# EAGLE design PSU R1 (EAGLE 9.6.2)
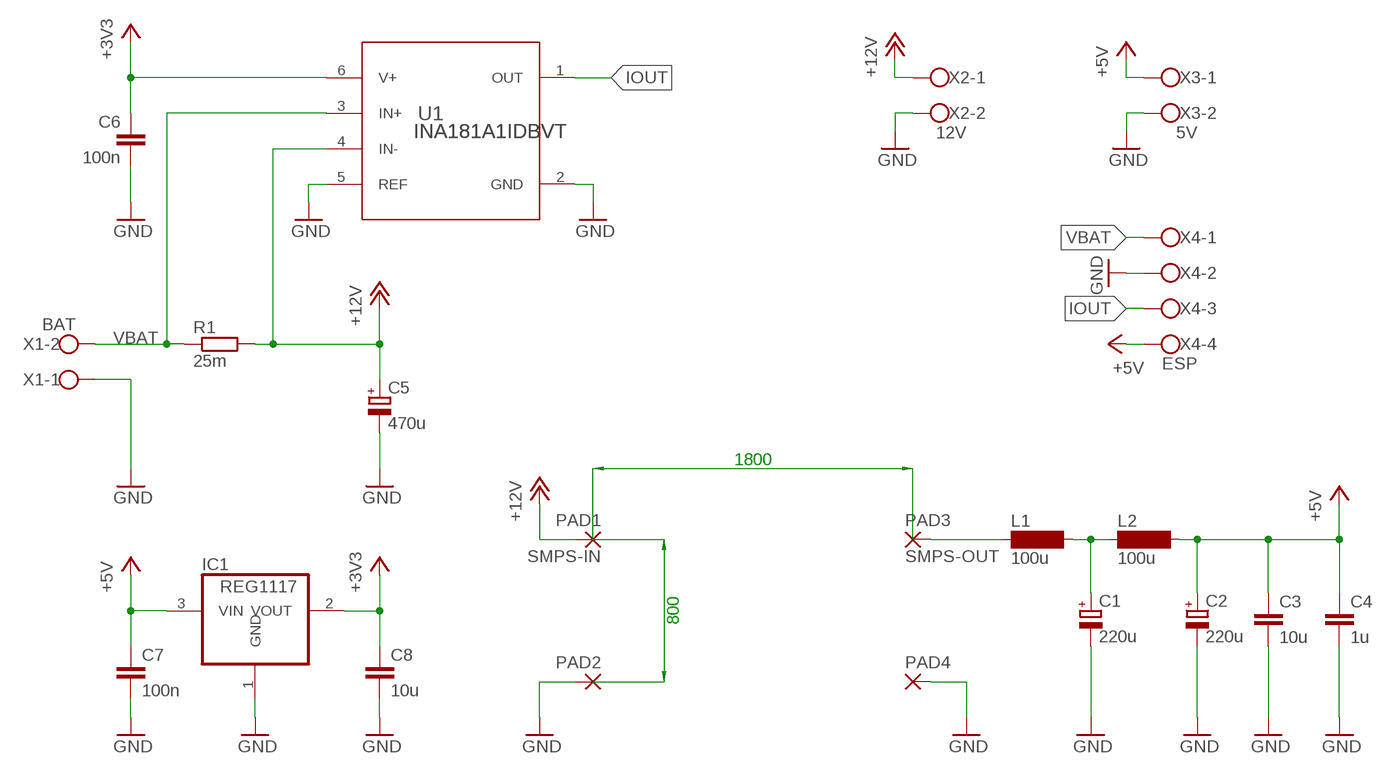
[diagram p0: schematic, sheet 1]

## Parts
C1  220u  CPOL-EUE2.5-6  [E2,5-6]
C2  220u  CPOL-EUE2.5-6  [E2,5-6]
C3  10u  C-EUC1206  [C1206]
C4  1u  C-EUC0805  [C0805]
C5  470u  CPOL-EUE5-10.5  [E5-10,5]
C6  100n  C-EUC0603  [C0603]
C7  100n  C-EUC0603  [C0603]
C8  10u  C-EUC1206  [C1206]
IC1  REG1117  [SOT223]
L1  100u  SD8  [SD8]
L2  100u  SD8  [SD8]
PAD1  SMPS-IN  1,6/0,9  [1,6/0,9]
PAD2  1,6/0,9  [1,6/0,9]
PAD3  SMPS-OUT  1,6/0,9  [1,6/0,9]
PAD4  1,6/0,9  [1,6/0,9]
R1  25m  R-EU_R2512  [R2512]
U1  INA181A1IDBVT  [DBV0006A_N]
X1  BAT  W237-102  [W237-102]
X2  12V  W237-102  [W237-102]
X3  5V  W237-102  [W237-102]
X4  ESP  W237-4  [W237-4]

## Nets
+3V3: C6.1 C8.1 IC1.2(VOUT) U1.6(V+)
+5V: C2.+ C3.1 C4.1 C7.1 IC1.3(VIN) L2.2 X3.1 X4.4
+12V: C5.+ PAD1.1(P) R1.2 U1.4(IN-) X2.1
GND: C1.- C2.- C3.2 C4.2 C5.- C6.2 C7.2 C8.2 IC1.1(GND) PAD2.1(P) PAD4.1(P) U1.2(GND) U1.5(REF) X1.1 X2.2 X3.2 X4.2
IOUT: U1.1(OUT) X4.3
N$1: L1.1 PAD3.1(P)
N$2: C1.+ L1.2 L2.1
VBAT: R1.1 U1.3(IN+) X1.2 X4.1

## Library data of the parts
C1 C2 C5 = rcl:CPOL-EU: POLARIZED CAPACITOR, European symbol; SPICEPREFIX: C
C3 C4 C6-C8 = rcl:C-EU: CAPACITOR, European symbol; SPICEPREFIX: C
IC1 = burr-brown:REG1117: 800mA and 1A Low Dropout (LDO) Positive Regulator 1.8V, 2.5V, 2.85V, 3.3V, 5V, and Adj; MPN: REG1117; OC_FARNELL: 1097566; OC_NEWARK: 14P6981
L1 L2 = inductor-neosid:SD8: INDUCTOR nominal inductance; OC_FARNELL: unknown; OC_NEWARK: unknown
PAD1-PAD4 = wirepad:1,6/0,9: THROUGH-HOLE PAD
R1 = rcl:R-EU_: RESISTOR, European symbol; SPICEPREFIX: R
U1 = user:INA181A1IDBVT; COPYRIGHT: Copyright (C) 2023 Ultra Librarian. All rights reserved.; MANUFACTURER_PART_NUMBER: INA181A1IDBVT; MFR_NAME: Texas Instruments; REFDES: RefDes; TYPE: TYPE
X1-X3 = con-wago-500:W237-102: WAGO SCREW CLAMP; MPN: 237-102; OC_FARNELL: unknown; OC_NEWARK: 70K9898
X4 = con-wago-500:W237-4: WAGO SCREW CLAMP; OC_FARNELL: unknown; OC_NEWARK: unknown

## Board
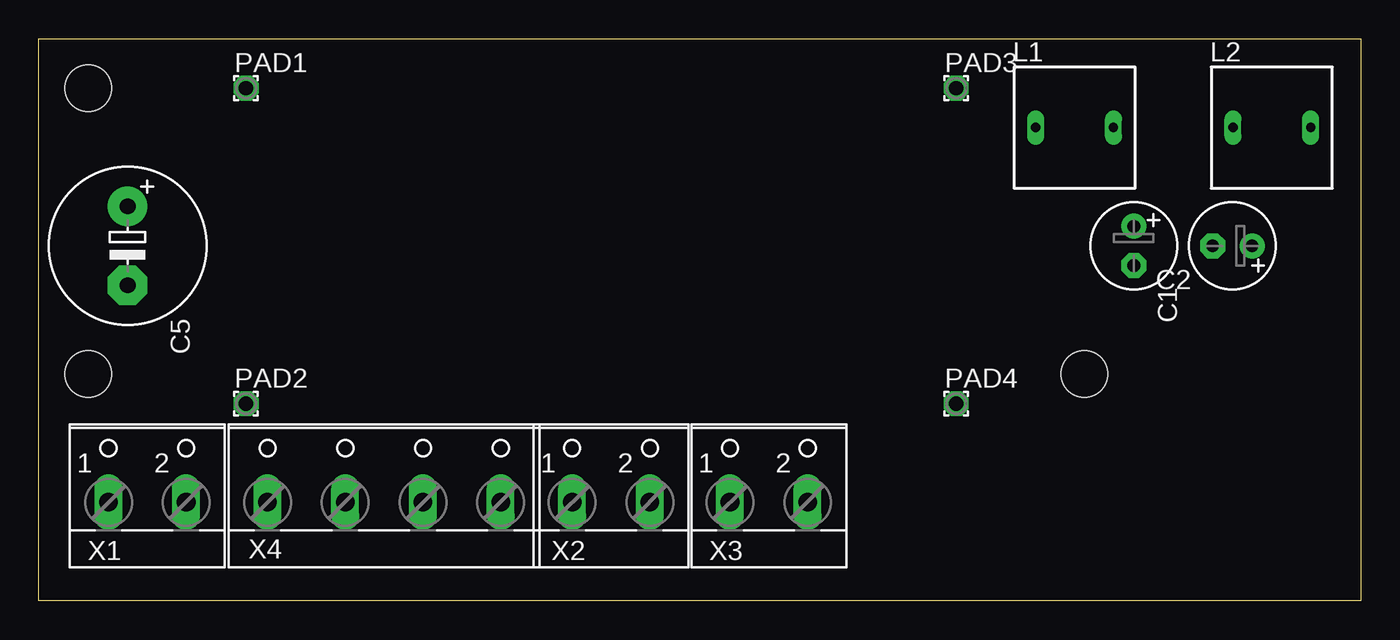
[diagram p1: board, top side]
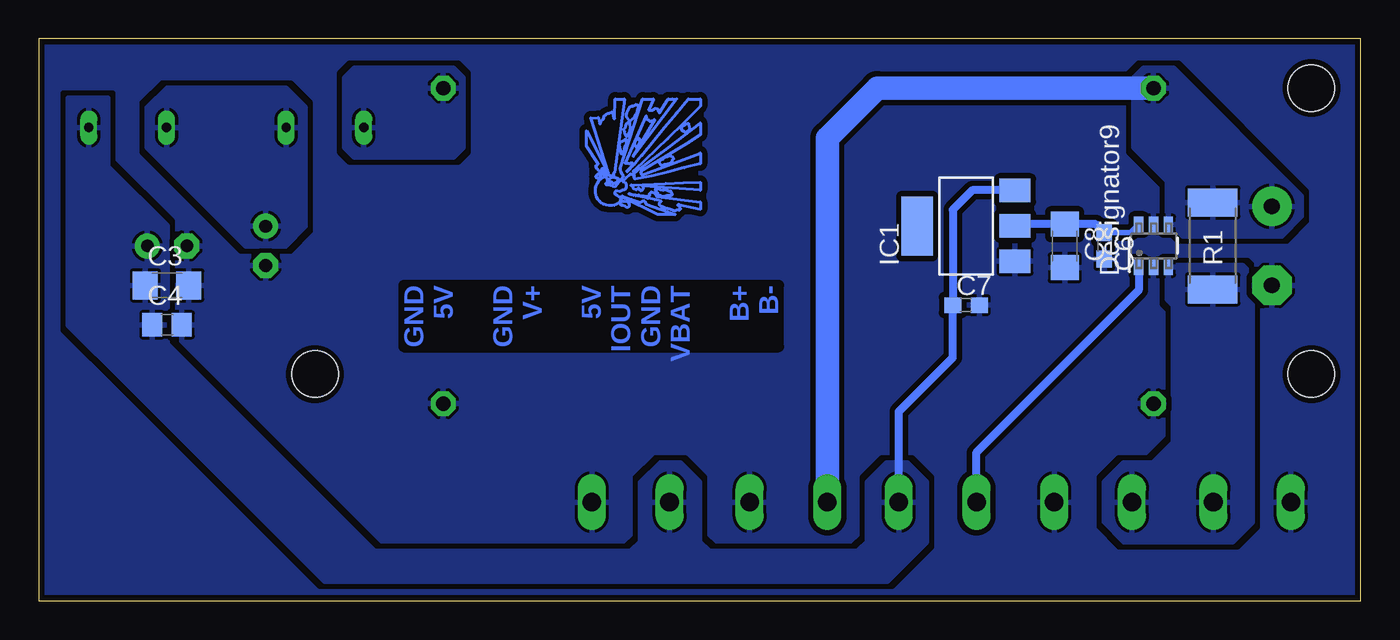
[diagram p2: board, bottom side, seen from below]

Size 85.09 x 36.2 mm. Coordinates in mm from the lower left corner, seen from the top.
Outline: 0,0 0,36.2 85.09,36.2 85.09,0 0,0
Copper layers (1*16): Top 0.035mm / dielectric 1.5mm / Bottom 0.035mm
Design rules "default": minimum track width 0.15mm, minimum drill 0.35mm, track to track 0.2mm, track to pad 0.2mm, pad to pad 0.2mm, via to via 0.2mm, smd to smd 0.2mm, copper to edge 0.002540625mm, drill to drill 6mil, minimum pad ring 10mil, minimum via ring 8mil, stop-mask expansion 4mil, vias tented up to drill 0mil, thermal gap 0.2mm
Holes 3 mm at 3.18,33.02 3.18,14.61 67.31,14.61

### Footprints (pad centres in the part's own frame; a part is rotated, then mirrored left to right if it is on the bottom)
E2,5-6 = drill 0.813 pad 1.6: + -1.27,0 | drill 0.813 pad 1.6 octagon: - 1.27,0
C1206 = smd 1.6 x 1.8: 1 -1.4,0; 2 1.4,0
C0805 = smd 1.3 x 1.5: 1 -0.95,0; 2 0.95,0
E5-10,5 = drill 1.016 pad 2.54: + -2.54,0 | drill 1.016 pad 2.54 octagon: - 2.54,0
C0603 = smd 1.1 x 1: 1 -0.85,0; 2 0.85,0
SOT223 = smd 1.499 x 2.007: 1 -2.261,-3.15; 2 0.025,-3.15; 3 2.311,-3.15 | smd 3.81 x 2.007: 4 0,3.15
SD8 = drill 0.6 long: 1 -2.5,0; 2 2.5,0
1,6/0,9 = drill 0.914 pad 1.6 octagon: 1 0,0
R2512 = smd 1.8 x 3.2: 1 -2.8,0; 2 2.8,0
DBV0006A_N = smd 1 x 0.6: 1 -1.375,0.95; 2 -1.375,0; 3 -1.375,-0.95; 4 1.375,-0.95; 5 1.375,0; 6 1.375,0.95
W237-102 = drill 1.194 long: 1 -2.5,-1.27; 2 2.5,-1.27
W237-4 = drill 1.194 long: 1 -7.5,-1.27; 2 -2.5,-1.27; 3 2.5,-1.27; 4 7.5,-1.27

### Placement (x,y rotation side)
C1  70.48,22.86 270 top
C2  76.84,22.86 180 top
C3  76.84,20.32 0 bottom
C4  76.84,17.78 0 bottom
C5  5.72,22.86 270 top
C6  16.51,22.86 270 bottom
C7  25.4,19.05 0 bottom
C8  19.05,22.86 270 bottom
IC1  25.4,24.13 90 bottom
L1  66.68,30.48 0 top
L2  79.38,30.48 0 top
PAD1  13.34,33.02 0 top
PAD2  13.34,12.7 0 top
PAD3  59.05,33.02 0 top
PAD4  59.05,12.7 0 top
R1  9.53,22.86 90 bottom
U1  13.34,22.86 90 bottom
X1  6.99,7.62 0 top
X2  36.83,7.62 0 top
X3  46.99,7.62 0 top
X4  22.23,7.62 0 top

### Tracks (layer width: path | path; a pad name or v marks a point on that pad's centre or on a via)
+3V3
  Bottom 0.35: U1.6 14.81,23.71 C6.1
  Bottom 0.5: C6.1 17.06,24.26 C8.1 22.15,24.26 IC1.2
+5V
  Bottom 0.5: IC1.3 24.99,26.44 26.25,25.19 C7.1 26.25,15.66 29.73,12.19 X4.4
  pour Bottom (isolate 0.3): 76.84,13.97 76.84,24.13 80.65,27.94 80.65,32.39 83.19,32.39 83.19,17.78 79.38,13.97
  pour Bottom (isolate 0.35): 76.84,19.05 79.38,19.05 79.38,13.97 66.68,1.27 30.48,1.27 27.94,3.81 27.94,7.62 29.21,8.89 30.48,8.89 31.75,7.62 31.75,3.81 32.39,3.18 41.91,3.18 42.55,3.81 42.55,7.62 43.81,8.89 45.09,8.89 46.36,7.62 46.36,3.81 46.99,3.18 63.5,3.18 76.84,16.51
+12V
  Bottom 1.5: X2.1 34.33,29.81 31.12,33.02 PAD1.1
  pour Bottom (isolate 0.35): 12.07,24.13 11.43,23.5 5.08,23.5 3.81,24.77 3.81,26.04 12.07,34.29 13.97,34.29 14.61,33.66 14.61,29.21 12.45,27.05 12.45,24.13
GND
  pour Bottom (isolate 0.35, rank 6): -5.71,-2.54 88.27,-2.54 88.27,39.37 -5.71,39.37
IOUT
  Bottom 0.5: U1.1 14.29,20.01 24.77,9.53 24.77,6.39 X4.3
N$1
  pour Bottom (isolate 0.35): 65.41,29.21 64.77,28.58 58.42,28.58 57.79,29.21 57.79,33.66 58.42,34.29 64.77,34.29 65.41,33.66
N$2
  pour Bottom (isolate 0.3): 69.22,22.86 71.75,22.86 78.1,29.21 78.1,31.75 76.84,33.02 69.22,33.02 67.94,31.75 67.94,24.13
N$3
  Bottom 0.2: 45.15,25.56 45.15,25.62
N$4
  Bottom 0.2: 45.94,30.99 45.96,31.03
N$5
  Bottom 0.2: 47.88,26.97 48,26.89
N$6
  Bottom 0.2: 46.41,29.54 46.57,29.21
N$7
  Bottom 0.2: 45.36,26.14 45.3,26.02
N$8
  Bottom 0.2: 47.91,26.4 47.97,26.37
N$9
  Bottom 0.2: 42.5,25.68 42.5,25.21
N$10
  Bottom 0.2: 45.16,28.27 45.11,28.35
N$11
  Bottom 0.2: 45.77,30.91 45.79,30.93
N$12
  Bottom 0.2: 43.92,25.47 43.88,25.47
N$13
  Bottom 0.2: 45.3,26.02 42.5,25.68
N$14
  Bottom 0.2: 45.05,26.1 45.19,26.13
N$15
  Bottom 0.2: 42.5,25.21 43.86,25.5
N$16
  Bottom 0.2: 46.77,27.27 46.76,27.41
N$17
  Bottom 0.2: 48.41,27.07 48.38,27.12
N$18
  Bottom 0.2: 43.86,25.5 43.91,25.51
N$19
  Bottom 0.2: 44.57,29.2 42.5,30.77
N$20
  Bottom 0.2: 43.91,25.51 43.95,25.51
N$21
  Bottom 0.2: 44.33,28.38 44.33,28.34
N$22
  Bottom 0.2: 45.43,30.97 45.46,30.98
N$23
  Bottom 0.2: 46.65,26.1 46.81,26.12
N$24
  Bottom 0.2: 46.19,27.26 46.72,27.17
N$25
  Bottom 0.2: 43.95,25.48 43.92,25.47
N$26
  Bottom 0.2: 44.33,25.18 44.43,25.21
N$27
  Bottom 0.2: 43.95,25.51 43.95,25.48
N$28
  Bottom 0.2: 48.7,27.57 48.69,27.53
N$29
  Bottom 0.2: 43.88,25.47 43.86,25.46
N$30
  Bottom 0.2: 45.56,26.31 45.48,26.27
N$31
  Bottom 0.2: 43.86,25.46 43.85,25.44
N$32
  Bottom 0.2: 44.4,28.83 46.31,27.69
N$33
  Bottom 0.2: 49.21,27.34 49.19,27.4
N$34
  Bottom 0.2: 43.85,25.44 43.83,25.34
N$35
  Bottom 0.2: 47.66,25.81 47.66,25.73
N$36
  Bottom 0.2: 45.08,25.67 45.05,25.7
N$37
  Bottom 0.2: 47.39,32.31 48.02,27.59
N$38
  Bottom 0.2: 44.61,28.11 44.72,28.1
N$39
  Bottom 0.2: 43.83,25.34 43.79,25.27
N$40
  Bottom 0.2: 46.78,27.43 46.86,27.45
N$41
  Bottom 0.2: 43.86,25.16 43.97,25.17
N$42
  Bottom 0.2: 49.11,27.49 49.07,27.5
N$43
  Bottom 0.2: 43.79,25.27 43.8,25.24
N$44
  Bottom 0.2: 47.59,25.73 47.52,25.75
N$45
  Bottom 0.2: 47.42,29.67 47.39,29.7
N$46
  Bottom 0.2: 43.8,25.24 43.81,25.21
N$47
  Bottom 0.2: 45.78,26.21 45.75,26.25
N$48
  Bottom 0.2: 47.43,30.36 47.4,30.41
N$49
  Bottom 0.2: 43.81,25.21 43.86,25.16
N$50
  Bottom 0.2: 45.72,26.28 45.65,26.33
N$51
  Bottom 0.2: 43.97,25.17 44.02,25.17
N$52
  Bottom 0.2: 45.92,25.93 46.65,26.1
N$53
  Bottom 0.2: 46.22,32.31 45.53,32.31
N$54
  Bottom 0.2: 47.66,25.6 47.7,25.64
N$55
  Bottom 0.2: 44.23,28.45 44.29,28.42
N$56
  Bottom 0.2: 44.02,25.17 44.06,25.15
N$57
  Bottom 0.2: 42.5,31.86 43.02,31.33
N$58
  Bottom 0.2: 47.13,27.72 47.15,27.7
N$59
  Bottom 0.2: 44.88,26.46 44.84,26.48
N$60
  Bottom 0.2: 45.59,30.9 45.63,30.89
N$61
  Bottom 0.2: 44.06,25.15 44.11,25.11
N$62
  Bottom 0.2: 49.26,26.29 49.26,26.45
N$63
  Bottom 0.2: 47.39,29.18 47.4,29.12
N$64
  Bottom 0.2: 44.11,25.11 44.15,25.1
N$65
  Bottom 0.2: 44.15,25.1 44.2,25.11
N$66
  Bottom 0.2: 47.26,31.26 47.25,31.37
N$67
  Bottom 0.2: 45.02,25.74 45.43,25.84
N$68
  Bottom 0.2: 46.07,25.71 46.04,25.63
N$69
  Bottom 0.2: 47.26,27.26 47.5,27
N$70
  Bottom 0.2: 48.72,31.13 48.71,31.18
N$71
  Bottom 0.2: 45.65,26.33 45.56,26.31
N$72
  Bottom 0.2: 48.61,27.37 48.56,27.29
N$73
  Bottom 0.2: 48.09,27.45 48.08,27.43
N$74
  Bottom 0.2: 44.2,25.11 44.24,25.13
N$75
  Bottom 0.2: 47.45,28.83 47.51,28.8
N$76
  Bottom 0.2: 44.77,25.28 44.81,25.31
N$77
  Bottom 0.2: 44.24,25.13 44.33,25.18
N$78
  Bottom 0.2: 44.4,26.37 44.38,26.33
N$79
  Bottom 0.2: 44.43,25.21 44.47,25.24
N$80
  Bottom 0.2: 44.47,25.24 44.52,25.25
N$81
  Bottom 0.2: 46.29,27.43 42.5,28.85
N$82
  Bottom 0.2: 46.46,26.14 45.8,26.08
N$83
  Bottom 0.2: 47.4,30.41 47.36,30.45
N$84
  Bottom 0.2: 44.87,25.32 44.92,25.34
N$85
  Bottom 0.2: 43.54,30.8 44.62,29.76
N$86
  Bottom 0.2: 45.24,26.54 45.08,26.49
N$87
  Bottom 0.2: 44.52,25.25 44.62,25.25
N$88
  Bottom 0.2: 47.43,26.99 47.4,26.98
N$89
  Bottom 0.2: 44.62,25.25 44.72,25.26
N$90
  Bottom 0.2: 44.72,25.26 44.77,25.28
N$91
  Bottom 0.2: 47.12,26.21 46.46,26.14
N$92
  Bottom 0.2: 44.81,25.31 44.87,25.32
N$93
  Bottom 0.2: 45.75,26.25 45.72,26.28
N$94
  Bottom 0.2: 45.03,28.41 44.95,28.45
N$95
  Bottom 0.2: 48.4,25.47 48.58,25.49
N$96
  Bottom 0.2: 44.92,25.34 44.97,25.38
N$97
  Bottom 0.2: 44.84,26.48 44.79,26.49
N$98
  Bottom 0.2: 44.88,28.06 44.96,28.04
N$99
  Bottom 0.2: 47.28,26.65 47.29,26.61
N$100
  Bottom 0.2: 44.97,25.38 45.03,25.39
N$101
  Bottom 0.2: 47.62,25.5 47.64,25.55
N$102
  Bottom 0.2: 45.03,25.39 45.12,25.5
N$103
  Bottom 0.2: 45.12,25.5 45.15,25.56
N$104
  Bottom 0.2: 45.15,25.62 45.08,25.67
N$105
  Bottom 0.2: 42.5,28.16 43.55,27.89
N$106
  Bottom 0.2: 47.5,26.46 47.55,26.45
N$107
  Bottom 0.2: 45.05,25.7 45.02,25.72
N$108
  Bottom 0.2: 47.09,25.41 47.11,25.38
N$109
  Bottom 0.2: 45.02,25.72 45.02,25.74
N$110
  Bottom 0.2: 45.43,25.84 45.84,25.93
N$111
  Bottom 0.2: 44.77,28.58 44.73,28.59
N$112
  Bottom 0.2: 46.93,28.21 46.88,28.19
N$113
  Bottom 0.2: 45.41,26.21 45.36,26.14
N$114
  Bottom 0.2: 45.84,25.93 45.92,25.93
N$115
  Bottom 0.2: 48.97,27.48 48.9,27.41
N$116
  Bottom 0.2: 46.81,26.12 46.96,26.15
N$117
  Bottom 0.2: 46.96,26.15 47.04,26.18
N$118
  Bottom 0.2: 47.04,30.32 47.06,30.24
N$119
  Bottom 0.2: 47.66,29.52 47.64,29.56
N$120
  Bottom 0.2: 47.04,26.18 47.12,26.21
N$121
  Bottom 0.2: 45.76,30.89 45.77,30.91
N$122
  Bottom 0.2: 45.78,26.1 45.77,26.14
N$123
  Bottom 0.2: 45.8,26.08 45.78,26.1
N$124
  Bottom 0.2: 48.34,27.16 48.32,27.22
N$125
  Bottom 0.2: 45.77,26.14 45.78,26.21
N$126
  Bottom 0.2: 47.71,29.36 47.71,29.42
N$127
  Bottom 0.2: 45.48,26.27 45.41,26.21
N$128
  Bottom 0.2: 47.66,25.73 47.64,25.72
N$129
  Bottom 0.2: 44.92,26.46 44.88,26.46
N$130
  Bottom 0.2: 47.67,29.11 47.68,29.17
N$131
  Bottom 0.2: 47.37,28.2 47.33,28.18
N$132
  Bottom 0.2: 48.4,27.4 48.46,27.42
N$133
  Bottom 0.2: 44.79,26.49 44.75,26.49
N$134
  Bottom 0.2: 47.65,26.37 47.7,26.37
N$135
  Bottom 0.2: 44.75,26.49 44.6,26.42
N$136
  Bottom 0.2: 44.6,26.42 44.51,26.4
N$137
  Bottom 0.2: 49.2,26.77 49.13,26.91
N$138
  Bottom 0.2: 44.51,26.4 44.43,26.39
N$139
  Bottom 0.2: 44.43,26.39 44.4,26.37
N$140
  Bottom 0.2: 44.38,26.33 44.37,26.26
N$141
  Bottom 0.2: 45.63,30.89 45.67,30.88
N$142
  Bottom 0.2: 44.37,26.26 44.34,26.21
N$143
  Bottom 0.2: 46.69,29.65 46.63,29.7
N$144
  Bottom 0.2: 44.34,26.21 44.33,26.18
N$145
  Bottom 0.2: 44.33,26.18 44.34,26.15
N$146
  Bottom 0.2: 48.59,26.87 48.59,26.83
N$147
  Bottom 0.2: 44.34,26.15 44.36,26.11
N$148
  Bottom 0.2: 44.34,28.3 44.38,28.25
N$149
  Bottom 0.2: 44.36,26.11 44.4,26.08
N$150
  Bottom 0.2: 48.03,26.27 48.03,26.22
N$151
  Bottom 0.2: 48.33,27.38 48.4,27.4
N$152
  Bottom 0.2: 44.4,26.08 44.47,26.08
N$153
  Bottom 0.2: 47.55,26.45 47.62,26.39
N$154
  Bottom 0.2: 44.47,26.08 44.54,26.1
N$155
  Bottom 0.2: 48.92,27.68 48.94,27.67
N$156
  Bottom 0.2: 44.54,26.1 44.64,26.08
N$157
  Bottom 0.2: 46.56,31.62 46.65,31.32
N$158
  Bottom 0.2: 48.07,27.55 48.1,27.51
N$159
  Bottom 0.2: 44.64,26.08 44.73,26.06
N$160
  Bottom 0.2: 44.73,26.06 44.83,26.04
N$161
  Bottom 0.2: 44.83,26.04 44.93,26.05
N$162
  Bottom 0.2: 47.71,29.42 47.68,29.48
N$163
  Bottom 0.2: 44.93,26.05 45.05,26.1
N$164
  Bottom 0.2: 43.33,30.75 43.28,30.76
N$165
  Bottom 0.2: 47.23,27.66 47.21,27.69
N$166
  Bottom 0.2: 45.19,26.13 45.23,26.15
N$167
  Bottom 0.2: 44.6,27.62 45.66,27.37
N$168
  Bottom 0.2: 46.63,31.94 46.58,31.94
N$169
  Bottom 0.2: 45.23,26.15 45.25,26.19
N$170
  Bottom 0.2: 45.25,26.19 45.25,26.29
N$171
  Bottom 0.2: 45.63,31.59 45.57,31.61
N$172
  Bottom 0.2: 47.07,28.15 47.02,28.18
N$173
  Bottom 0.2: 45.25,26.29 45.34,26.39
N$174
  Bottom 0.2: 47.29,26.81 47.28,26.73
N$175
  Bottom 0.2: 45.34,26.39 45.38,26.45
N$176
  Bottom 0.2: 46.98,27.92 46.97,27.92
N$177
  Bottom 0.2: 45.38,26.45 45.39,26.53
N$178
  Bottom 0.2: 46.94,28.01 46.94,27.99
N$179
  Bottom 0.2: 46.7,31.28 46.73,31.22
N$180
  Bottom 0.2: 45.39,26.53 45.36,26.55
N$181
  Bottom 0.2: 45.3,31.7 45.26,31.67
N$182
  Bottom 0.2: 45.36,26.55 45.33,26.56
N$183
  Bottom 0.2: 45.55,30.92 45.59,30.9
N$184
  Bottom 0.2: 45.33,26.56 45.24,26.54
N$185
  Bottom 0.2: 45.08,26.49 44.92,26.46
N$186
  Bottom 0.2: 49.02,27.67 49.08,27.72
N$187
  Bottom 0.2: 42.51,26.95 42.5,26.44
N$188
  Bottom 0.2: 47.18,27.75 47.09,27.84
N$189
  Bottom 0.2: 46.4,29.65 46.41,29.54
N$190
  Bottom 0.2: 46.34,27.55 46.32,27.48
N$191
  Bottom 0.2: 42.5,26.44 46.21,26.71
N$192
  Bottom 0.2: 46.21,26.71 46.23,26.7
N$193
  Bottom 0.2: 46.68,29.28 46.72,29.38
N$194
  Bottom 0.2: 46.23,26.7 46.2,26.66
N$195
  Bottom 0.2: 46.2,26.66 46.19,26.61
N$196
  Bottom 0.2: 46.57,29.21 46.59,29.2
N$197
  Bottom 0.2: 47.33,28.18 47.29,28.18
N$198
  Bottom 0.2: 46.19,26.61 46.19,26.56
N$199
  Bottom 0.2: 48.5,26.97 48.56,26.91
N$200
  Bottom 0.2: 46.19,26.56 46.2,26.51
N$201
  Bottom 0.2: 47.46,26.03 46.91,25.86
N$202
  Bottom 0.2: 48.06,31.07 48.04,31.07
N$203
  Bottom 0.2: 46.2,26.51 46.26,26.45
N$204
  Bottom 0.2: 46.44,29.78 46.41,29.73
N$205
  Bottom 0.2: 46.26,26.45 46.33,26.41
N$206
  Bottom 0.2: 48.72,27.3 48.68,27.33
N$207
  Bottom 0.2: 46.33,26.41 46.38,26.43
N$208
  Bottom 0.2: 47.11,27.74 47.13,27.72
N$209
  Bottom 0.2: 46.38,26.43 46.42,26.46
N$210
  Bottom 0.2: 47.17,27.68 47.19,27.66
N$211
  Bottom 0.2: 49.13,26.91 49.03,27.05
N$212
  Bottom 0.2: 46.93,31.86 46.86,31.87
N$213
  Bottom 0.2: 46.42,26.46 46.43,26.5
N$214
  Bottom 0.2: 47.07,27.79 47.08,27.78
N$215
  Bottom 0.2: 46.43,26.5 46.43,26.53
N$216
  Bottom 0.2: 46.43,26.53 46.43,26.56
N$217
  Bottom 0.2: 44.39,28.65 44.35,28.63
N$218
  Bottom 0.2: 47.14,27.38 47.26,27.26
N$219
  Bottom 0.2: 46.43,26.56 46.46,26.58
N$220
  Bottom 0.2: 47.04,31.81 46.99,31.84
N$221
  Bottom 0.2: 46.46,26.58 46.51,26.56
N$222
  Bottom 0.2: 49.02,27.24 49.06,27.23
N$223
  Bottom 0.2: 46.51,26.56 46.55,26.53
N$224
  Bottom 0.2: 47.04,27.83 47.05,27.81
N$225
  Bottom 0.2: 46.55,26.53 46.62,26.48
N$226
  Bottom 0.2: 46.62,26.48 46.69,26.49
N$227
  Bottom 0.2: 46.69,26.49 46.76,26.52
N$228
  Bottom 0.2: 46.76,26.52 46.82,26.57
N$229
  Bottom 0.2: 46.82,26.57 46.86,26.64
N$230
  Bottom 0.2: 47.06,30.24 47.09,30.17
N$231
  Bottom 0.2: 46.86,26.64 46.85,26.67
N$232
  Bottom 0.2: 46.85,26.67 46.83,26.69
N$233
  Bottom 0.2: 46.83,26.69 46.82,26.72
N$234
  Bottom 0.2: 44.58,28.65 44.51,28.68
N$235
  Bottom 0.2: 48.56,27.29 48.52,27.17
N$236
  Bottom 0.2: 46.82,26.72 46.84,26.75
N$237
  Bottom 0.2: 46.31,27.45 46.29,27.43
N$238
  Bottom 0.2: 46.84,26.75 46.91,26.75
N$239
  Bottom 0.2: 47.31,26.57 47.35,26.49
N$240
  Bottom 0.2: 47.25,31.37 47.18,31.57
N$241
  Bottom 0.2: 46.91,26.75 46.97,26.77
N$242
  Bottom 0.2: 44.38,28.25 44.48,28.15
N$243
  Bottom 0.2: 46.33,27.63 46.34,27.55
N$244
  Bottom 0.2: 46.97,26.77 46.96,26.78
N$245
  Bottom 0.2: 46.96,26.78 44.73,26.88
N$246
  Bottom 0.2: 47.7,25.64 47.94,25.53
N$247
  Bottom 0.2: 44.73,26.88 43.62,26.93
N$248
  Bottom 0.2: 47.68,29.22 47.71,29.36
N$249
  Bottom 0.2: 47.08,31.76 47.04,31.81
N$250
  Bottom 0.2: 43.62,26.93 42.51,26.95
N$251
  Bottom 0.2: 47.89,27.23 47.82,27.22
N$252
  Bottom 0.2: 45.81,30.95 45.9,30.97
N$253
  Bottom 0.2: 47.82,27.22 47.79,27.2
N$254
  Bottom 0.2: 48.86,27.81 48.87,27.76
N$255
  Bottom 0.2: 47.79,27.2 47.79,27.17
N$256
  Bottom 0.2: 46,25.56 44.11,24.89
N$257
  Bottom 0.2: 47.79,27.17 47.78,27.15
N$258
  Bottom 0.2: 47.78,27.15 47.79,27.12
N$259
  Bottom 0.2: 45.12,28.16 45.15,28.21
N$260
  Bottom 0.2: 48.87,27.76 48.9,27.7
N$261
  Bottom 0.2: 47.79,27.12 47.82,27.08
N$262
  Bottom 0.2: 47.82,27.08 47.82,27.05
N$263
  Bottom 0.2: 47.82,27.05 47.84,27.02
N$264
  Bottom 0.2: 45.07,28.12 45.12,28.16
N$265
  Bottom 0.2: 47.84,27.02 47.88,26.97
N$266
  Bottom 0.2: 46.6,28.31 46.44,28.52
N$267
  Bottom 0.2: 46.15,25.78 46.12,25.77
N$268
  Bottom 0.2: 45.67,30.88 45.71,30.88
N$269
  Bottom 0.2: 48,26.89 48.06,26.88
N$270
  Bottom 0.2: 48.49,27.06 48.49,27.01
N$271
  Bottom 0.2: 48.06,26.88 48.11,26.9
N$272
  Bottom 0.2: 48.02,26.31 48.03,26.27
N$273
  Bottom 0.2: 48.11,26.9 48.2,26.96
N$274
  Bottom 0.2: 47.82,26.1 47.76,26.03
N$275
  Bottom 0.2: 46.79,31.11 46.91,31.02
N$276
  Bottom 0.2: 43.7,30.31 43.71,30.38
N$277
  Bottom 0.2: 48.2,26.96 48.26,26.96
N$278
  Bottom 0.2: 48.26,26.96 48.33,26.95
N$279
  Bottom 0.2: 48.33,26.95 48.39,26.96
N$280
  Bottom 0.2: 48.39,26.96 48.41,26.98
N$281
  Bottom 0.2: 49.1,25.86 49.18,25.99
N$282
  Bottom 0.2: 48.41,26.98 48.43,27.01
N$283
  Bottom 0.2: 49.23,26.14 49.26,26.29
N$284
  Bottom 0.2: 48.43,27.01 48.41,27.07
N$285
  Bottom 0.2: 46.83,27.66 46.83,27.64
N$286
  Bottom 0.2: 48.38,27.12 48.34,27.16
N$287
  Bottom 0.2: 48.32,27.22 48.27,27.25
N$288
  Bottom 0.2: 47.64,25.88 47.66,25.81
N$289
  Bottom 0.2: 48.27,27.25 48.2,27.28
N$290
  Bottom 0.2: 44.35,28.63 44.29,28.57
N$291
  Bottom 0.2: 48.2,27.28 48.06,27.3
N$292
  Bottom 0.2: 47.11,25.38 47.13,25.39
N$293
  Bottom 0.2: 47.1,30.95 47.15,31.01
N$294
  Bottom 0.2: 48.06,27.3 48.02,27.29
N$295
  Bottom 0.2: 45.9,30.97 45.94,30.99
N$296
  Bottom 0.2: 48.02,27.29 47.97,27.27
N$297
  Bottom 0.2: 46.94,27.46 46.98,27.48
N$298
  Bottom 0.2: 47.97,27.27 47.93,27.25
N$299
  Bottom 0.2: 47.13,25.39 47.19,25.34
N$300
  Bottom 0.2: 47.93,27.25 47.89,27.23
N$301
  Bottom 0.2: 48.59,31.32 48.47,31.38
N$302
  Bottom 0.2: 47.62,28.89 47.63,28.99
N$303
  Bottom 0.2: 47.05,27.81 47.07,27.79
N$304
  Bottom 0.2: 48.9,27.41 48.97,27.31
N$305
  Bottom 0.2: 47.52,25.75 47.41,25.74
N$306
  Bottom 0.2: 48.97,27.31 48.99,27.27
N$307
  Bottom 0.2: 48.99,27.27 49.02,27.24
N$308
  Bottom 0.2: 49.06,27.23 49.1,27.22
N$309
  Bottom 0.2: 46.72,27.17 46.76,27.21
N$310
  Bottom 0.2: 47.26,25.34 47.32,25.39
N$311
  Bottom 0.2: 49.1,27.22 49.16,27.23
N$312
  Bottom 0.2: 49.16,27.23 49.2,27.24
N$313
  Bottom 0.2: 49.2,27.24 49.22,27.28
N$314
  Bottom 0.2: 49.22,27.28 49.21,27.34
N$315
  Bottom 0.2: 49.19,27.4 49.15,27.45
N$316
  Bottom 0.2: 49.15,27.45 49.11,27.49
N$317
  Bottom 0.2: 47.16,25.66 47.09,25.62
N$318
  Bottom 0.2: 49.07,27.5 49.03,27.5
N$319
  Bottom 0.2: 49.03,27.5 48.97,27.48
N$320
  Bottom 0.2: 48.71,27.6 48.7,27.57
N$321
  Bottom 0.2: 46.86,27.45 46.94,27.46
N$322
  Bottom 0.2: 48.69,27.53 48.7,27.49
N$323
  Bottom 0.2: 43.53,30.66 43.47,30.67
N$324
  Bottom 0.2: 46.83,27.64 46.73,27.62
N$325
  Bottom 0.2: 48.7,27.49 48.69,27.5
N$326
  Bottom 0.2: 43.02,31.33 43.54,30.8
N$327
  Bottom 0.2: 48.69,27.5 48.7,27.49
N$328
  Bottom 0.2: 47.56,25.48 47.59,25.49
N$329
  Bottom 0.2: 48.7,27.49 48.77,27.46
N$330
  Bottom 0.2: 48.77,27.46 48.86,27.45
N$331
  Bottom 0.2: 48.86,27.45 48.88,27.47
N$332
  Bottom 0.2: 47.22,25.72 47.16,25.66
N$333
  Bottom 0.2: 49.84,30.28 48.44,27.54
N$334
  Bottom 0.2: 48.88,27.47 48.89,27.5
N$335
  Bottom 0.2: 47.15,31.01 47.25,31.14
N$336
  Bottom 0.2: 48.89,27.5 48.9,27.56
N$337
  Bottom 0.2: 48.9,27.56 48.86,27.59
N$338
  Bottom 0.2: 46.87,28.17 46.92,28.07
N$339
  Bottom 0.2: 43.2,30.36 43.26,30.3
N$340
  Bottom 0.2: 47.76,26.03 47.64,26.02
N$341
  Bottom 0.2: 48.86,27.59 48.81,27.61
N$342
  Bottom 0.2: 48.81,27.61 48.76,27.61
N$343
  Bottom 0.2: 48.76,27.61 48.71,27.6
N$344
  Bottom 0.2: 46.97,27.92 46.98,27.91
N$345
  Bottom 0.2: 46.98,27.91 46.99,27.89
N$346
  Bottom 0.2: 46.99,27.89 47.01,27.87
N$347
  Bottom 0.2: 46.12,25.77 46.09,25.74
N$348
  Bottom 0.2: 47.01,27.87 47.02,27.85
N$349
  Bottom 0.2: 47.02,27.85 47.04,27.83
N$350
  Bottom 0.2: 42.5,30.77 42.5,30.01
N$351
  Bottom 0.2: 47.08,27.78 47.1,27.76
N$352
  Bottom 0.2: 47.1,27.76 47.11,27.74
N$353
  Bottom 0.2: 47.09,30.17 47.13,30.11
N$354
  Bottom 0.2: 47.15,27.7 47.17,27.68
N$355
  Bottom 0.2: 47.19,27.66 47.2,27.65
N$356
  Bottom 0.2: 47.2,27.65 47.22,27.63
N$357
  Bottom 0.2: 47.48,25.47 47.56,25.48
N$358
  Bottom 0.2: 47.22,27.63 47.23,27.66
N$359
  Bottom 0.2: 48.89,30.9 48.77,31.02
N$360
  Bottom 0.2: 47.21,27.69 47.18,27.75
N$361
  Bottom 0.2: 47.09,27.84 47.04,27.89
N$362
  Bottom 0.2: 46.69,27.62 46.64,27.64
N$363
  Bottom 0.2: 47.04,27.89 46.98,27.92
N$364
  Bottom 0.2: 44.29,28.57 44.26,28.52
N$365
  Bottom 0.2: 47.64,26.02 47.59,26.03
N$366
  Bottom 0.2: 44.26,28.52 44.23,28.45
N$367
  Bottom 0.2: 44.29,28.42 44.31,28.41
N$368
  Bottom 0.2: 44.72,28.1 44.76,28.1
N$369
  Bottom 0.2: 43.57,30.64 43.53,30.66
N$370
  Bottom 0.2: 44.31,28.41 44.33,28.38
N$371
  Bottom 0.2: 47.4,25.44 47.48,25.47
N$372
  Bottom 0.2: 44.33,28.34 44.34,28.3
N$373
  Bottom 0.2: 44.48,28.15 44.54,28.12
N$374
  Bottom 0.2: 44.54,28.12 44.61,28.11
N$375
  Bottom 0.2: 44.76,28.1 44.8,28.09
N$376
  Bottom 0.2: 46,31.24 47.37,28.2
N$377
  Bottom 0.2: 44.8,28.09 44.88,28.06
N$378
  Bottom 0.2: 46.24,25.74 46.2,25.77
N$379
  Bottom 0.2: 44.96,28.04 45,28.05
N$380
  Bottom 0.2: 45,28.05 45.04,28.07
N$381
  Bottom 0.2: 45.04,28.07 45.07,28.12
N$382
  Bottom 0.2: 45.15,28.21 45.16,28.24
N$383
  Bottom 0.2: 45.16,28.24 45.16,28.27
N$384
  Bottom 0.2: 47.19,30.8 47.14,30.83
N$385
  Bottom 0.2: 45.11,28.35 45.03,28.41
N$386
  Bottom 0.2: 44.95,28.45 44.86,28.48
N$387
  Bottom 0.2: 45.38,31.72 45.3,31.7
N$388
  Bottom 0.2: 47.09,25.62 47.08,25.58
N$389
  Bottom 0.2: 44.86,28.48 44.8,28.55
N$390
  Bottom 0.2: 44.8,28.55 44.77,28.58
N$391
  Bottom 0.2: 47.4,30.28 47.44,30.31
N$392
  Bottom 0.2: 44.73,28.59 44.65,28.61
N$393
  Bottom 0.2: 47.49,25.96 47.54,25.96
N$394
  Bottom 0.2: 44.65,28.61 44.58,28.65
N$395
  Bottom 0.2: 44.51,28.68 44.47,28.68
N$396
  Bottom 0.2: 44.04,32.32 46.84,28.61
N$397
  Bottom 0.2: 44.47,28.68 44.43,28.67
N$398
  Bottom 0.2: 44.43,28.67 44.39,28.65
N$399
  Bottom 0.2: 47.29,29.71 47.28,29.52
N$400
  Bottom 0.2: 47.28,29.52 47.27,29.46
N$401
  Bottom 0.2: 47.27,29.46 47.29,29.41
N$402
  Bottom 0.2: 47.29,29.41 47.33,29.32
N$403
  Bottom 0.2: 47.33,29.32 47.37,29.23
N$404
  Bottom 0.2: 46.76,27.21 46.77,27.27
N$405
  Bottom 0.2: 47.21,29.9 47.26,29.92
N$406
  Bottom 0.2: 47.37,29.23 47.39,29.18
N$407
  Bottom 0.2: 47.4,29.12 47.42,29.04
N$408
  Bottom 0.2: 46.92,28.07 46.94,28.01
N$409
  Bottom 0.2: 47.42,29.04 47.44,28.95
N$410
  Bottom 0.2: 46.64,27.64 44.57,29.2
N$411
  Bottom 0.2: 47.44,28.95 47.45,28.89
N$412
  Bottom 0.2: 49.03,27.05 48.91,27.17
N$413
  Bottom 0.2: 47.45,28.89 47.45,28.83
N$414
  Bottom 0.2: 47.51,28.8 47.55,28.78
N$415
  Bottom 0.2: 47.55,28.78 47.58,28.79
N$416
  Bottom 0.2: 47.58,28.79 47.61,28.83
N$417
  Bottom 0.2: 47.61,28.83 47.62,28.89
N$418
  Bottom 0.2: 47.65,27.77 47.66,27.84
N$419
  Bottom 0.2: 47.63,28.99 47.67,29.11
N$420
  Bottom 0.2: 45.2,31.53 45.18,31.47
N$421
  Bottom 0.2: 47.68,29.17 47.68,29.22
N$422
  Bottom 0.2: 47.68,29.48 47.66,29.52
N$423
  Bottom 0.2: 47.64,29.56 47.57,29.59
N$424
  Bottom 0.2: 46.41,29.73 46.4,29.7
N$425
  Bottom 0.2: 47.94,25.53 48.06,25.49
N$426
  Bottom 0.2: 47.57,29.59 47.49,29.62
N$427
  Bottom 0.2: 47.49,29.62 47.42,29.67
N$428
  Bottom 0.2: 46.93,27.98 46.85,28.03
N$429
  Bottom 0.2: 47.39,29.7 47.36,29.73
N$430
  Bottom 0.2: 48.56,26.8 48.53,26.79
N$431
  Bottom 0.2: 47.36,29.73 47.33,29.73
N$432
  Bottom 0.2: 47.33,29.73 47.29,29.71
N$433
  Bottom 0.2: 46.4,29.7 46.4,29.65
N$434
  Bottom 0.2: 46.59,29.2 46.63,29.2
N$435
  Bottom 0.2: 46.91,25.86 46.34,25.66
N$436
  Bottom 0.2: 48.83,27.86 48.86,27.81
N$437
  Bottom 0.2: 46.63,29.2 46.68,29.28
N$438
  Bottom 0.2: 46.72,29.38 46.73,29.47
N$439
  Bottom 0.2: 47.51,26.05 47.46,26.03
N$440
  Bottom 0.2: 46.73,29.47 46.71,29.57
N$441
  Bottom 0.2: 47.4,26.98 47.37,26.96
N$442
  Bottom 0.2: 46.71,29.57 46.7,29.61
N$443
  Bottom 0.2: 46.7,29.61 46.69,29.65
N$444
  Bottom 0.2: 46.63,29.7 46.56,29.75
N$445
  Bottom 0.2: 46.56,29.75 46.49,29.8
N$446
  Bottom 0.2: 44.62,29.76 46.78,27.72
N$447
  Bottom 0.2: 46.49,29.8 46.46,29.8
N$448
  Bottom 0.2: 46.46,29.8 46.44,29.78
N$449
  Bottom 0.2: 46.78,27.72 46.82,27.68
N$450
  Bottom 0.2: 46.2,25.77 46.15,25.78
N$451
  Bottom 0.2: 45.53,32.31 45.83,31.62
N$452
  Bottom 0.2: 45.83,31.62 45.77,31.59
N$453
  Bottom 0.2: 45.77,31.59 45.7,31.59
N$454
  Bottom 0.2: 45.7,31.59 45.63,31.59
N$455
  Bottom 0.2: 45.57,31.61 45.48,31.66
N$456
  Bottom 0.2: 47.53,27.45 47.6,27.6
N$457
  Bottom 0.2: 45.48,31.66 45.38,31.72
N$458
  Bottom 0.2: 47.13,30.11 47.16,30.04
N$459
  Bottom 0.2: 46.44,28.52 46.3,28.68
N$460
  Bottom 0.2: 45.26,31.67 45.23,31.63
N$461
  Bottom 0.2: 45.23,31.63 45.22,31.58
N$462
  Bottom 0.2: 48.36,26.8 48.33,26.79
N$463
  Bottom 0.2: 45.22,31.58 45.2,31.53
N$464
  Bottom 0.2: 48.26,27.35 48.33,27.38
N$465
  Bottom 0.2: 49.24,26.61 49.2,26.77
N$466
  Bottom 0.2: 45.18,31.47 45.14,31.44
N$467
  Bottom 0.2: 46.09,25.74 46.07,25.71
N$468
  Bottom 0.2: 45.14,31.44 44.58,32.32
N$469
  Bottom 0.2: 47.09,25.5 47.09,25.46
N$470
  Bottom 0.2: 44.58,32.32 44.31,32.32
N$471
  Bottom 0.2: 47.31,26.89 47.29,26.81
N$472
  Bottom 0.2: 49.18,25.99 49.23,26.14
N$473
  Bottom 0.2: 44.31,32.32 44.04,32.32
N$474
  Bottom 0.2: 43.6,30.24 43.66,30.27
N$475
  Bottom 0.2: 46.84,28.61 45.51,30.82
N$476
  Bottom 0.2: 45.51,30.82 45.46,30.9
N$477
  Bottom 0.2: 45.71,30.88 45.74,30.86
N$478
  Bottom 0.2: 45.46,30.9 45.43,30.97
N$479
  Bottom 0.2: 45.74,30.86 45.76,30.89
N$480
  Bottom 0.2: 45.46,30.98 45.48,30.98
N$481
  Bottom 0.2: 45.48,30.98 45.52,30.96
N$482
  Bottom 0.2: 45.52,30.96 45.55,30.92
N$483
  Bottom 0.2: 47.7,26.37 47.84,26.4
N$484
  Bottom 0.2: 45.79,30.93 45.81,30.95
N$485
  Bottom 0.2: 45.96,31.03 45.97,31.14
N$486
  Bottom 0.2: 46.65,31.32 46.7,31.28
N$487
  Bottom 0.2: 45.97,31.14 45.97,31.19
N$488
  Bottom 0.2: 45.97,31.19 45.99,31.24
N$489
  Bottom 0.2: 45.99,31.24 46,31.24
N$490
  Bottom 0.2: 47.29,28.18 47.22,28.19
N$491
  Bottom 0.2: 47.22,28.19 47.14,28.19
N$492
  Bottom 0.2: 48.89,25.63 49.01,25.74
N$493
  Bottom 0.2: 47.14,28.19 47.1,28.18
N$494
  Bottom 0.2: 47.1,28.18 47.07,28.15
N$495
  Bottom 0.2: 46.32,27.48 46.31,27.45
N$496
  Bottom 0.2: 47.18,31.57 47.08,31.76
N$497
  Bottom 0.2: 47.34,30.09 47.37,30.22
N$498
  Bottom 0.2: 47.02,28.18 46.98,28.2
N$499
  Bottom 0.2: 46.98,28.2 46.93,28.21
N$500
  Bottom 0.2: 46.88,28.19 46.87,28.17
N$501
  Bottom 0.2: 46.94,27.99 46.93,27.98
N$502
  Bottom 0.2: 46.73,31.22 46.79,31.11
N$503
  Bottom 0.2: 46.85,28.03 46.77,28.11
N$504
  Bottom 0.2: 47.58,25.94 47.64,25.88
N$505
  Bottom 0.2: 46.77,28.11 46.6,28.31
N$506
  Bottom 0.2: 42.5,30.01 43.44,29.41
N$507
  Bottom 0.2: 48.92,30.8 48.89,30.9
N$508
  Bottom 0.2: 46.3,28.68 44.81,30.51
N$509
  Bottom 0.2: 47.37,26.96 47.31,26.89
N$510
  Bottom 0.2: 44.81,30.51 44.06,31.42
N$511
  Bottom 0.2: 44.06,31.42 43.29,32.31
N$512
  Bottom 0.2: 47.09,25.54 47.09,25.5
N$513
  Bottom 0.2: 43.29,32.31 42.5,32.31
N$514
  Bottom 0.2: 42.5,32.31 42.5,31.86
N$515
  Bottom 0.2: 46.98,27.48 47,27.5
N$516
  Bottom 0.2: 46.76,27.41 46.76,27.42
N$517
  Bottom 0.2: 47.6,27.6 47.65,27.77
N$518
  Bottom 0.2: 46.82,27.68 46.83,27.66
N$519
  Bottom 0.2: 46.73,27.62 46.69,27.62
N$520
  Bottom 0.2: 43.47,30.67 43.38,30.73
N$521
  Bottom 0.2: 43.44,29.41 44.4,28.83
N$522
  Bottom 0.2: 48.17,26.73 47.99,26.69
N$523
  Bottom 0.2: 46.31,27.69 46.33,27.63
N$524
  Bottom 0.2: 49.18,28.08 49.14,28.09
N$525
  Bottom 0.2: 42.5,28.85 42.5,28.16
N$526
  Bottom 0.2: 43.55,27.89 44.6,27.62
N$527
  Bottom 0.2: 47.54,26.07 47.51,26.05
N$528
  Bottom 0.2: 45.66,27.37 46.19,27.26
N$529
  Bottom 0.2: 48.1,27.51 48.09,27.45
N$530
  Bottom 0.2: 46.76,27.42 46.78,27.43
N$531
  Bottom 0.2: 47,27.5 47.14,27.38
N$532
  Bottom 0.2: 47.5,27 47.43,26.99
N$533
  Bottom 0.2: 47.28,26.73 47.28,26.65
N$534
  Bottom 0.2: 47.29,26.61 47.31,26.57
N$535
  Bottom 0.2: 47.35,26.49 47.4,26.46
N$536
  Bottom 0.2: 47.4,26.46 47.45,26.46
N$537
  Bottom 0.2: 47.45,26.46 47.5,26.46
N$538
  Bottom 0.2: 47.62,26.39 47.65,26.37
N$539
  Bottom 0.2: 47.84,26.4 47.91,26.4
N$540
  Bottom 0.2: 47.97,26.37 48.02,26.31
N$541
  Bottom 0.2: 48.03,26.22 47.88,26.14
N$542
  Bottom 0.2: 48.77,31.02 48.74,31.07
N$543
  Bottom 0.2: 47.88,26.14 47.82,26.1
N$544
  Bottom 0.2: 47.59,26.03 47.54,26.07
N$545
  Bottom 0.2: 46.34,25.66 46.32,25.7
N$546
  Bottom 0.2: 46.32,25.7 46.28,25.72
N$547
  Bottom 0.2: 46.28,25.72 46.24,25.74
N$548
  Bottom 0.2: 46.04,25.63 46,25.56
N$549
  Bottom 0.2: 48.04,31.07 48.03,31.08
N$550
  Bottom 0.2: 44.11,24.89 44.11,24.88
N$551
  Bottom 0.2: 47.41,25.74 47.22,25.72
N$552
  Bottom 0.2: 44.11,24.88 45.25,24.88
N$553
  Bottom 0.2: 45.25,24.88 47.49,25.96
N$554
  Bottom 0.2: 47.54,25.96 47.58,25.94
N$555
  Bottom 0.2: 47.64,25.72 47.62,25.72
N$556
  Bottom 0.2: 47.62,25.72 47.59,25.73
N$557
  Bottom 0.2: 47.08,25.58 47.09,25.54
N$558
  Bottom 0.2: 48.07,31.08 48.06,31.07
N$559
  Bottom 0.2: 47.09,25.46 47.09,25.41
N$560
  Bottom 0.2: 47.19,25.34 47.22,25.33
N$561
  Bottom 0.2: 47.22,25.33 47.26,25.34
N$562
  Bottom 0.2: 47.32,25.39 47.4,25.44
N$563
  Bottom 0.2: 47.59,25.49 47.62,25.5
N$564
  Bottom 0.2: 43.41,30.19 43.44,30.16
N$565
  Bottom 0.2: 47.64,25.55 47.66,25.6
N$566
  Bottom 0.2: 48.06,25.49 48.19,25.47
N$567
  Bottom 0.2: 48.19,25.47 48.4,25.47
N$568
  Bottom 0.2: 48.58,25.49 48.74,25.55
N$569
  Bottom 0.2: 48.74,25.55 48.89,25.63
N$570
  Bottom 0.2: 49.01,25.74 49.1,25.86
N$571
  Bottom 0.2: 49.26,26.45 49.24,26.61
N$572
  Bottom 0.2: 48.91,27.17 48.76,27.28
N$573
  Bottom 0.2: 49.56,31.09 49.06,31.13
N$574
  Bottom 0.2: 48.76,27.28 48.72,27.3
N$575
  Bottom 0.2: 48.68,27.33 48.64,27.36
N$576
  Bottom 0.2: 48.64,27.36 48.61,27.37
N$577
  Bottom 0.2: 48.52,27.17 48.49,27.06
N$578
  Bottom 0.2: 48.94,27.67 48.99,27.66
N$579
  Bottom 0.2: 48.49,27.01 48.5,26.97
N$580
  Bottom 0.2: 48.56,26.91 48.59,26.87
N$581
  Bottom 0.2: 48.59,26.83 48.56,26.8
N$582
  Bottom 0.2: 48.53,26.79 48.47,26.8
N$583
  Bottom 0.2: 48.47,26.8 48.4,26.81
N$584
  Bottom 0.2: 48.4,26.81 48.36,26.8
N$585
  Bottom 0.2: 48.33,26.79 48.27,26.76
N$586
  Bottom 0.2: 48.27,26.76 48.17,26.73
N$587
  Bottom 0.2: 47.36,30.45 47.33,30.49
N$588
  Bottom 0.2: 47.99,26.69 47.46,27.34
N$589
  Bottom 0.2: 47.46,27.34 47.53,27.45
N$590
  Bottom 0.2: 47.66,27.84 47.66,27.9
N$591
  Bottom 0.2: 47.66,27.9 46.22,32.31
N$592
  Bottom 0.2: 48.02,27.59 48.07,27.55
N$593
  Bottom 0.2: 48.18,31.45 48.15,31.41
N$594
  Bottom 0.2: 47.33,30.49 47.3,30.6
N$595
  Bottom 0.2: 48.08,27.43 48.1,27.42
N$596
  Bottom 0.2: 48.1,27.42 48.18,27.37
N$597
  Bottom 0.2: 48.18,27.37 48.22,27.35
N$598
  Bottom 0.2: 48.22,27.35 48.26,27.35
N$599
  Bottom 0.2: 48.46,27.42 48.52,27.47
N$600
  Bottom 0.2: 48.52,27.47 48.69,27.68
N$601
  Bottom 0.2: 48.69,27.68 48.83,27.86
N$602
  Bottom 0.2: 47.14,30.83 47.07,30.84
N$603
  Bottom 0.2: 48.9,27.7 48.92,27.68
N$604
  Bottom 0.2: 49.84,29.28 49.84,30.28
N$605
  Bottom 0.2: 48.99,27.66 49.01,27.66
N$606
  Bottom 0.2: 49.01,27.66 49.02,27.67
N$607
  Bottom 0.2: 49.08,27.72 49.11,27.77
N$608
  Bottom 0.2: 49.11,27.77 49.14,27.82
N$609
  Bottom 0.2: 49.14,27.82 49.19,27.86
N$610
  Bottom 0.2: 49.19,27.86 49.21,27.9
N$611
  Bottom 0.2: 49.21,27.9 49.22,27.95
N$612
  Bottom 0.2: 49.22,27.95 49.22,28.05
N$613
  Bottom 0.2: 49.22,28.05 49.18,28.08
N$614
  Bottom 0.2: 49.14,28.09 49.1,28.11
N$615
  Bottom 0.2: 49.1,28.11 49.08,28.14
N$616
  Bottom 0.2: 49.08,28.14 49.84,29.28
N$617
  Bottom 0.2: 48.44,27.54 48.43,27.54
N$618
  Bottom 0.2: 48.43,27.54 49.56,31.09
N$619
  Bottom 0.2: 49.06,31.13 49.02,30.92
N$620
  Bottom 0.2: 49.02,30.92 48.98,30.7
N$621
  Bottom 0.2: 48.98,30.7 48.95,30.72
N$622
  Bottom 0.2: 48.95,30.72 48.94,30.74
N$623
  Bottom 0.2: 48.94,30.74 48.92,30.8
N$624
  Bottom 0.2: 48.74,31.07 48.72,31.13
N$625
  Bottom 0.2: 48.71,31.18 48.69,31.24
N$626
  Bottom 0.2: 48.69,31.24 48.59,31.32
N$627
  Bottom 0.2: 48.47,31.38 48.22,31.49
N$628
  Bottom 0.2: 48.22,31.49 48.18,31.45
N$629
  Bottom 0.2: 48.15,31.41 48.12,31.3
N$630
  Bottom 0.2: 48.12,31.3 48.1,31.19
N$631
  Bottom 0.2: 48.1,31.19 48.07,31.08
N$632
  Bottom 0.2: 48.03,31.08 47.99,32.31
N$633
  Bottom 0.2: 47.99,32.31 47.39,32.31
N$634
  Bottom 0.2: 43.28,30.76 43.25,30.7
N$635
  Bottom 0.2: 43.25,30.7 43.22,30.57
N$636
  Bottom 0.2: 43.22,30.57 43.2,30.44
N$637
  Bottom 0.2: 43.2,30.44 43.2,30.36
N$638
  Bottom 0.2: 43.26,30.3 43.33,30.24
N$639
  Bottom 0.2: 43.33,30.24 43.37,30.22
N$640
  Bottom 0.2: 46.52,31.91 46.51,31.88
N$641
  Bottom 0.2: 43.37,30.22 43.41,30.19
N$642
  Bottom 0.2: 43.44,30.16 43.46,30.16
N$643
  Bottom 0.2: 43.46,30.16 43.49,30.17
N$644
  Bottom 0.2: 43.49,30.17 43.54,30.21
N$645
  Bottom 0.2: 43.54,30.21 43.6,30.24
N$646
  Bottom 0.2: 47.23,30.76 47.19,30.8
N$647
  Bottom 0.2: 43.66,30.27 43.7,30.31
N$648
  Bottom 0.2: 43.71,30.38 43.72,30.45
N$649
  Bottom 0.2: 43.72,30.45 43.71,30.51
N$650
  Bottom 0.2: 43.71,30.51 43.68,30.57
N$651
  Bottom 0.2: 43.68,30.57 43.62,30.6
N$652
  Bottom 0.2: 43.62,30.6 43.57,30.64
N$653
  Bottom 0.2: 43.38,30.73 43.33,30.75
N$654
  Bottom 0.2: 47.07,30.84 47.04,30.32
N$655
  Bottom 0.2: 47.16,30.04 47.21,29.9
N$656
  Bottom 0.2: 47.26,29.92 47.3,29.96
N$657
  Bottom 0.2: 47.3,29.96 47.33,30.02
N$658
  Bottom 0.2: 47.33,30.02 47.34,30.09
N$659
  Bottom 0.2: 47.37,30.22 47.4,30.28
N$660
  Bottom 0.2: 47.44,30.31 47.43,30.36
N$661
  Bottom 0.2: 47.3,30.6 47.26,30.71
N$662
  Bottom 0.2: 47.26,30.71 47.23,30.76
N$663
  Bottom 0.2: 46.51,31.88 46.56,31.62
N$664
  Bottom 0.2: 46.91,31.02 47.02,30.9
N$665
  Bottom 0.2: 47.02,30.9 47.1,30.95
N$666
  Bottom 0.2: 47.25,31.14 47.26,31.26
N$667
  Bottom 0.2: 46.99,31.84 46.93,31.86
N$668
  Bottom 0.2: 46.86,31.87 46.68,31.96
N$669
  Bottom 0.2: 46.68,31.96 46.63,31.94
N$670
  Bottom 0.2: 46.58,31.94 46.53,31.93
N$671
  Bottom 0.2: 46.53,31.93 46.52,31.91
VBAT
  pour Bottom (isolate 0.35): 6.99,5.08 6.99,20.96 7.62,21.59 12.45,21.59 12.45,19.43 12.07,19.05 12.07,5.08 10.8,3.81 8.26,3.81
  pour Bottom (isolate 0.35): 6.99,5.08 8.26,3.81 15.24,3.81 16.51,5.08 16.51,7.62 15.24,8.89 13.34,8.89 12.07,10.16 6.99,10.16

### Text on the board
Bottom: GND / 5V / / GND / V+ / / 5V / IOUT / GND / VBAT / / B+ / B-